# Altium schematic sheet Relay_Connector_Block.SchDoc
size A4; CheckedBy: CT-Energys; Author: CT-Energys; CompanyName: HTD COMPANY LIMITED; DrawnBy: CHITOAN; Engineer: CHITOAN; Organization: Altium Limited; Address1: HO CHI MINH CITY; Address2: VIETNAM
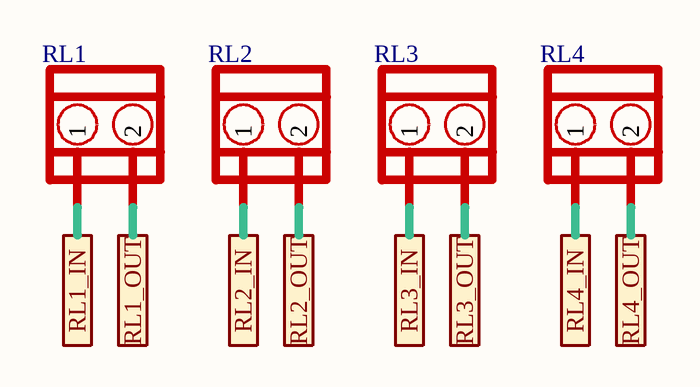
[diagram p0: Relay_Connector_Block.SchDoc]

## Parts
H7  RL1  [KF301-2-V]
H8  RL2  [KF301-2-V]
H9  RL3  [KF301-2-V]
H10  RL4  [KF301-2-V]

## Ports
RL1_IN, RL1_OUT, RL2_IN, RL2_OUT, RL3_IN, RL3_OUT, RL4_IN, RL4_OUT

## Nets
RL1_IN: H7.1 ; port RL1_IN
RL1_OUT: H7.2 ; port RL1_OUT
RL2_IN: H8.1 ; port RL2_IN
RL2_OUT: H8.2 ; port RL2_OUT
RL3_IN: H9.1 ; port RL3_IN
RL3_OUT: H9.2 ; port RL3_OUT
RL4_IN: H10.1 ; port RL4_IN
RL4_OUT: H10.2 ; port RL4_OUT

## Notes on the sheet
- Title
- Size:
- Date:
- A4
- Number:
- Time:
- Revision:
- Design by:
- Company:
- File:

## Library data of the parts
H7-H10 = KF301-2-V: Connector 5.08MM Pitch Vertical 2 Pole